# Altium schematic sheet Dataflow.SchDoc
size A3; SheetNumber: 2; SheetTotal: 3
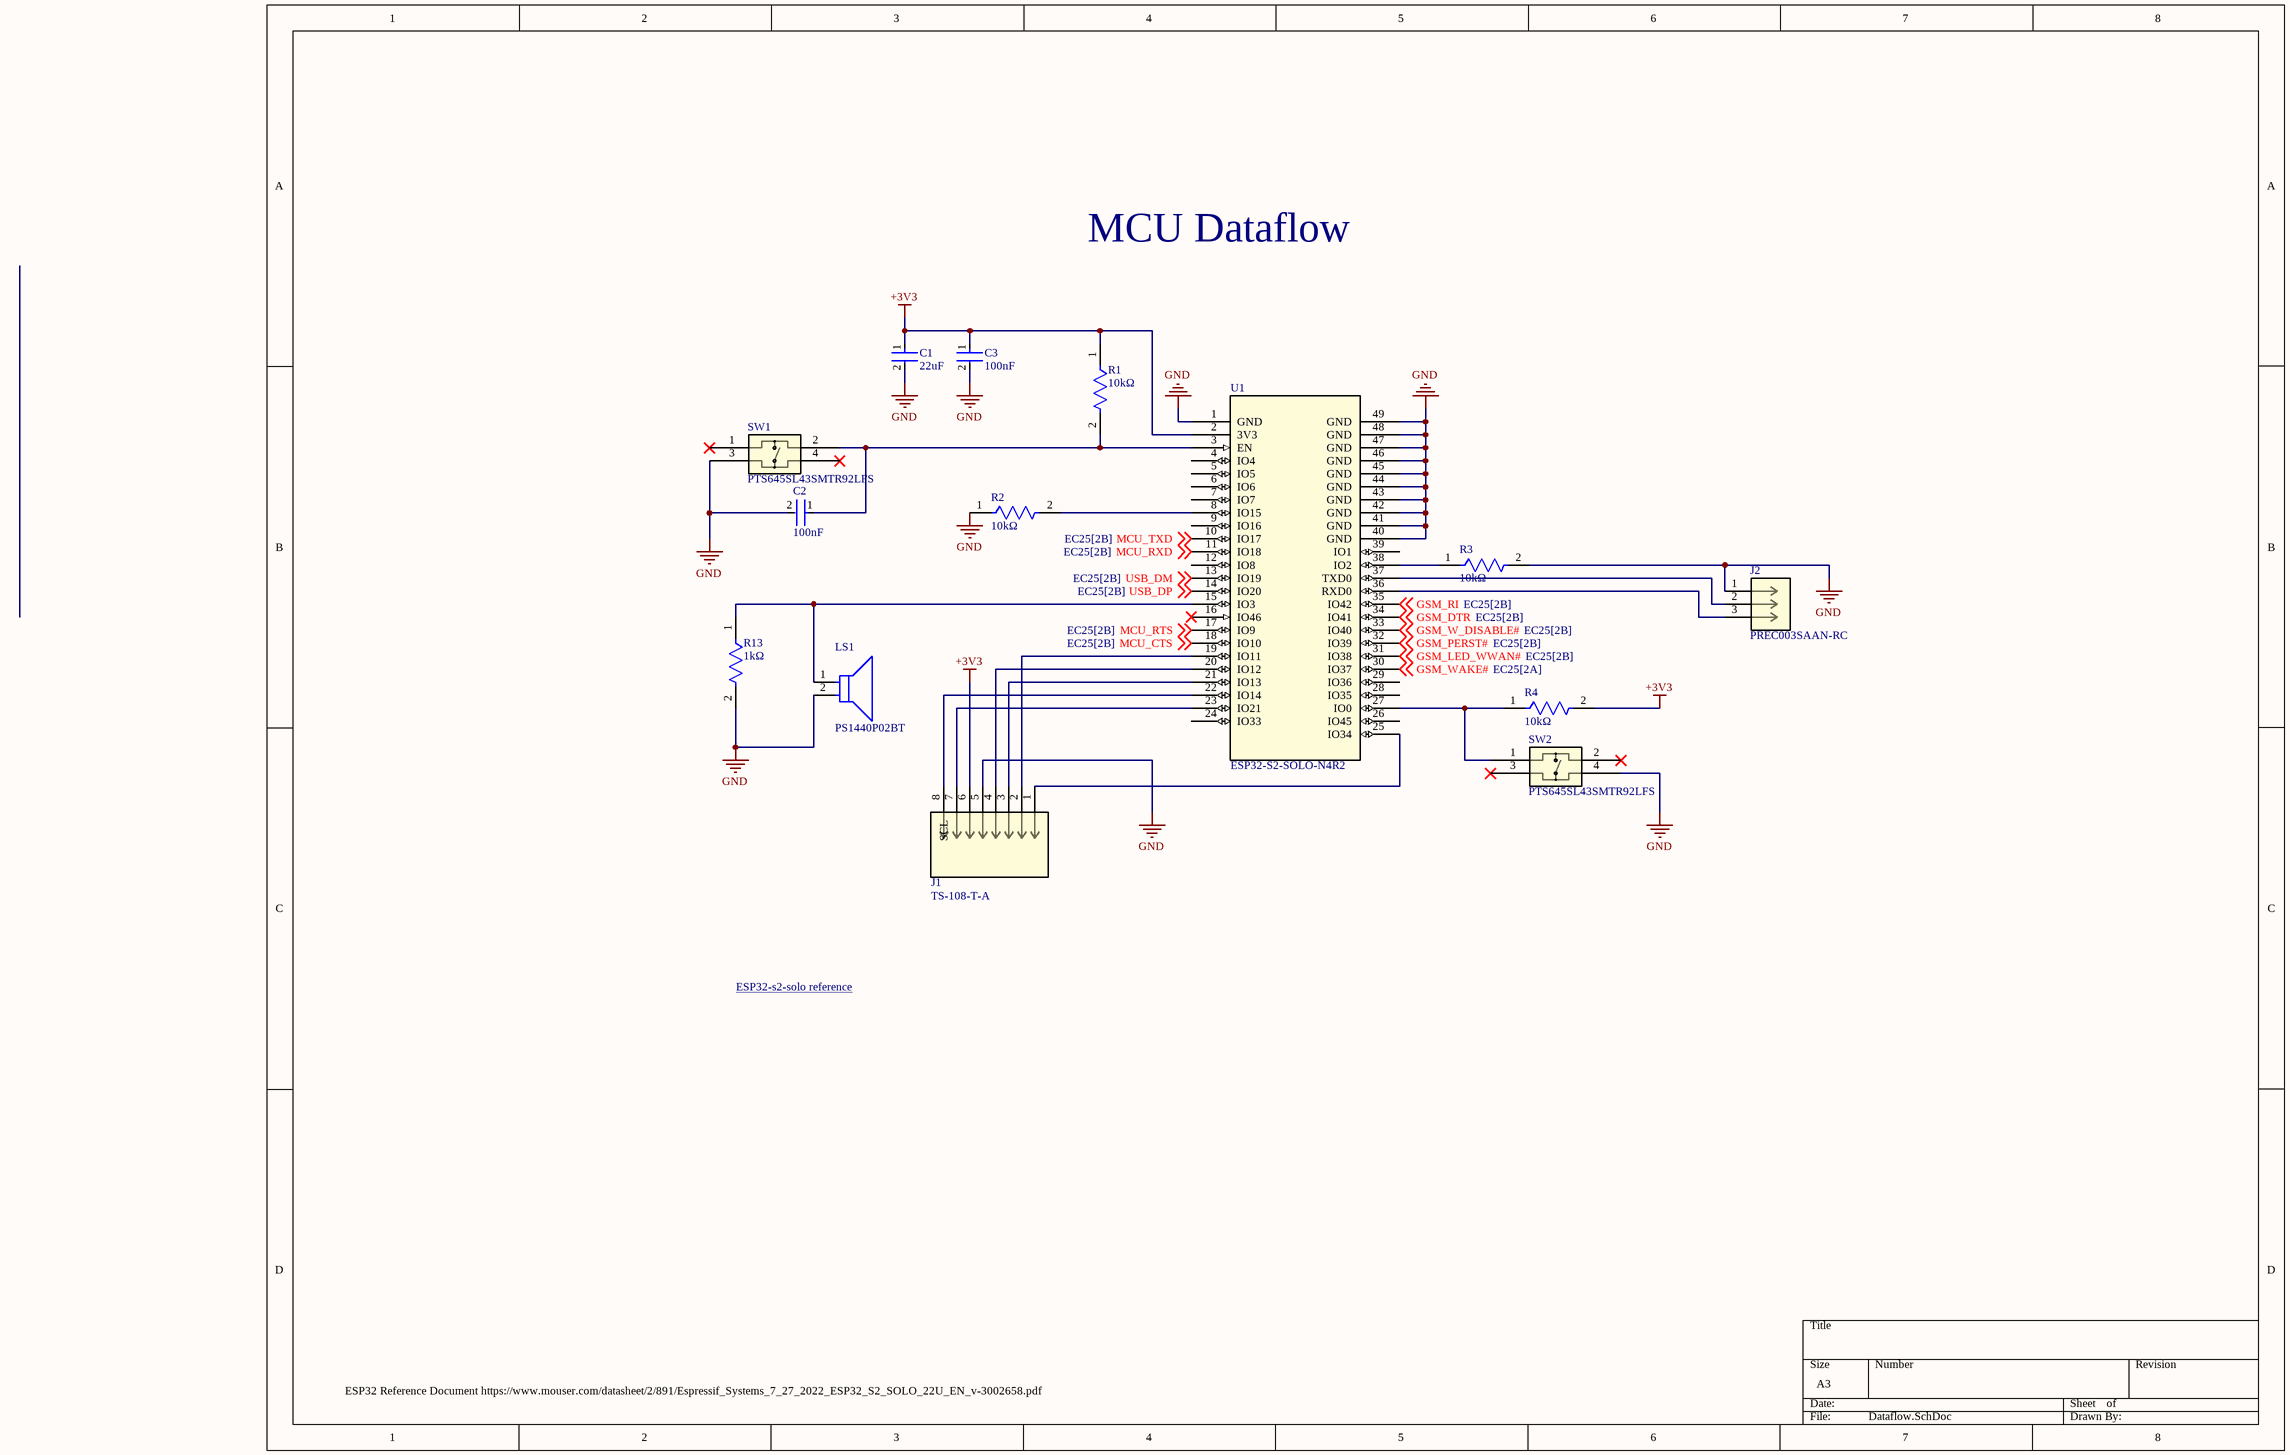
[diagram p0: Dataflow.SchDoc]

## Parts
C1  22uF  [FP-CL21-IPC_C]
C2  100nF  [FP-CL21-IPC_C]
C3  100nF  [FP-CL21-IPC_C]
J1  TS-108-T-A  [CON8_1X8_TU_HTS_SAI]
J2  PREC003SAAN-RC  [CONN_PREC003SAAN-RC_SUL]
LS1  PS1440P02BT  [FP-PS1440P02BT-MFG]
R1  10kΩ  [FP-CRGP2512-IPC_C]
R2  10kΩ  [FP-CRGP2512-IPC_C]
R3  10kΩ  [FP-CRGP2512-IPC_C]
R4  10kΩ  [FP-CRGP2512-IPC_C]
R13  1kΩ  [FP-CRGP2512-IPC_C]
SW1  PTS645SL43SMTR92LFS  [PTS645SL43SMTR92LFS_CNK]
SW2  PTS645SL43SMTR92LFS  [PTS645SL43SMTR92LFS_CNK]
U1  ESP32-S2-SOLO-N4R2  [MOD41_ESP32-S2-SOLO_EXP]

## Nets
+3V3: C1.1 C3.1 J1.6(+3V3) R1.1 R4.2 U1.2(3V3)
GND: C1.2 C2.2 C3.2 J1.5(GND) J2.1 LS1.2 R2.1 R3.2 R13.2 SW1.3 SW2.4 U1.1(GND) U1.40(GND) U1.41(GND) U1.42(GND) U1.43(GND) U1.44(GND) U1.45(GND) U1.46(GND) U1.47(GND) U1.48(GND) U1.49(GND)
GSM_DTR: U1.34(IO41) ; off-sheet GSM_DTR
GSM_LED_WWAN#: U1.31(IO38) ; off-sheet GSM_LED_WWAN#
GSM_PERST#: U1.32(IO39) ; off-sheet GSM_PERST#
GSM_RI: U1.35(IO42) ; off-sheet GSM_RI
GSM_W_DISABLE#: U1.33(IO40) ; off-sheet GSM_W_DISABLE#
GSM_WAKE#: U1.30(IO37) ; off-sheet GSM_WAKE#
MCU_CTS: U1.18(IO10) ; off-sheet MCU_CTS
MCU_RTS: U1.17(IO9) ; off-sheet MCU_RTS
MCU_RXD: U1.11(IO18) ; off-sheet MCU_RXD
MCU_TXD: U1.10(IO17) ; off-sheet MCU_TXD
USB_DM: U1.13(IO19) ; off-sheet USB_DM
USB_DP: U1.14(IO20) ; off-sheet USB_DP
NetC2_1: C2.1 R1.2 SW1.2 U1.3(EN)
NetJ1_1: J1.1(CS) U1.25(IO34)
NetJ1_2: J1.2(MOSI) U1.19(IO11)
NetJ1_3: J1.3(MISO) U1.21(IO13)
NetJ1_4: J1.4(SCLK) U1.20(IO12)
NetJ1_7: J1.7(SDA) U1.23(IO21)
NetJ1_8: J1.8(SCL) U1.22(IO14)
NetJ2_2: J2.2 U1.37(TXD0)
NetJ2_3: J2.3 U1.36(RXD0)
NetLS1_1: LS1.1 R13.1 U1.15(IO3)
NetR2_2: R2.2 U1.8(IO15)
NetR3_1: R3.1 U1.38(IO2)
NetR4_1: R4.1 SW2.1 U1.27(IO0)

Not connected (* = marked no-connect by the designer): SW1 1* 4*; SW2 2* 3*; U1 4(IO4) 5(IO5) 6(IO6) 7(IO7) 9(IO16) 12(IO8) 16(IO46)* 24(IO33) 26(IO45) 28(IO35) 29(IO36) 39(IO1)

## Notes on the sheet
- MCU Dataflow
- ESP32-s2-solo reference <https://www.espressif.com/sites/default/files/documentation/esp32-s2-solo-2_esp32-s2-solo-2u_datasheet_en.pdf>
- ESP32 Reference Document https://www.mouser.com/datasheet/2/891/Espressif_Systems_7_27_2022_ESP32_S2_SOLO_22U_EN_v-3002658.pdf

## Library data of the parts
C1 = CMP-13271-003225-1: CL21A226MAYNNNE CL21 Series 0805 22uF 25V ±20% Tolerance X5R Multilayer Ceramic Chip Capacitor
C2 C3 = CMP-13271-002854-1: CL21B104KACNNNC CL21 Series 0805 100nF 25V ±10% Tolerance X7R Multilayer Ceramic Chip Capacitor; Thickness: 0.037inch; Dielectric: X7R; Packaging: Tape and Reel; Height: 0.85mm; Case/Package: 0805; Mount: Surface Mount; Case Code (Imperial): 0805; Capacitance: 100nF; Case Code (Metric): 2012; Length: 2mm; Voltage Rating: 25V; Voltage: 25V; Contact Plating: Tin; Tolerance: 10%; Max Operating Temperature: 125°C; Width: 0.049inch; Min Operating Temperature: -55°C; Radiation Hardening: No; Package Quantity: 1; Depth: 1.25mm
J1 = TS-108-T-A: No Description Available; Mfr_Name: Samtec Inc; RefDes: RefDes; Type: Type
J2 = PREC003SAAN-RC: No Description Available; Mfr_Name: Sullins; Digi-Key_Part_Number_1: S1012EC-03-ND; RefDes: RefDes; Type: Type
LS1 = CMP-08413-000003-1: AUDIO PIEZO TRANSDUCER 30V TH; Self Resonant Frequency: 4kHz; Washable: No; Voltage Rating (DC): 3V; Number of Terminals/Pins: 2; Packaging: Tape and Reel; Lead Free: Lead Free; Min Operating Temperature: -10°C; Package Quantity: 350; Termination: PC Pins; Mount: Through Hole; Max Operating Temperature: 70°C; Operating Supply Voltage: 3V; Diameter: 14mm; RoHS Compliant: Yes; Frequency: 4kHz; Height: 8mm
R1-R4 = CMP-03211-007941-1: CRGP2512F10K CRGP 2512 10K 1%; Manufacturer: TE; Voltage Rating: 500V; Tolerance: 0.01; Temperature Coefficient: ±100ppm/°C; Description: CRGP2512 10KΩ 2W ±100ppm/°C 1% 500V; Power Rating: 2W; ComponentLink2Description: Datasheet; Series: CRGP; Temperature: -55°C to +155°C; ComponentLink2URL: https://www.mouser.ca/datasheet/2/418/NG_DS_9-1773463-9_A-1358566.pdf; Device Class L3: Chip SMD Resistors; Temperature Range High: +155°C; Ipc Land Pattern Name: RESC635320X55; Manufacturer Part Number: CRGP2512F10K; Height: 0.65mm; RoHS: TRUE; Ambient Temperature Range High: +70°C; Lead Free: Yes; Composition: Thick Film; Device Class L1: Passive Components; Automotive: No; Octopart: https://octopart.com/crgp2512f10k-te+connectivity-91019026; Digikey Description: CRGP 2512 10K 1%; Value: 10KΩ; Package: CRGP2512; Temperature Range Low: -55°C; Resistance: 10KΩ; Category: Res; Device Class L2: Resistors
R13 = CMP-03211-007859-1: CRGP2512F1K0 Res, 1K, 1%, 2W, 2512, Thick Film; Manufacturer: TE; Temperature Coefficient: ±100ppm/°C; Voltage Rating: 500V; Description: CRGP2512 1KΩ 2W ±100ppm/°C 1% 500V; Tolerance: 0.01; Power Rating: 2W; Composition: Thick Film; Temperature Range Low: -55°C; Device Class L3: Chip SMD Resistors; Value: 1KΩ; Device Class L2: Resistors; Device Class L1: Passive Components; Temperature: -55°C to +155°C; Category: Res; Automotive: No; Manufacturer Part Number: CRGP2512F1K0; Ipc Land Pattern Name: RESC635320X55; Digikey Description: Res, 1K, 1%, 2W, 2512, Thick Film; Height: 0.65mm; Octopart: https://octopart.com/crgp2512f1k0-te+connectivity-91019040; Package: CRGP2512; Series: CRGP; Ambient Temperature Range High: +70°C; Lead Free: Yes; Resistance: 1KΩ; Temperature Range High: +155°C; RoHS: TRUE; ComponentLink2Description: Datasheet; ComponentLink2URL: https://www.mouser.ca/datasheet/2/418/NG_DS_9-1773463-9_A-1358566.pdf
SW1 SW2 = PTS645SL43SMTR92LFS: No Description Available; Mfr_Name: C&K Components; RefDes: RefDes; Type: Type
U1 = ESP32-S2-SOLO-N4R2: No Description Available; Mfr_Name: Espressif Systems; Type: RF; RefDes: RefDes